# Altium project Compact Inverter Power V5.PrjPcb
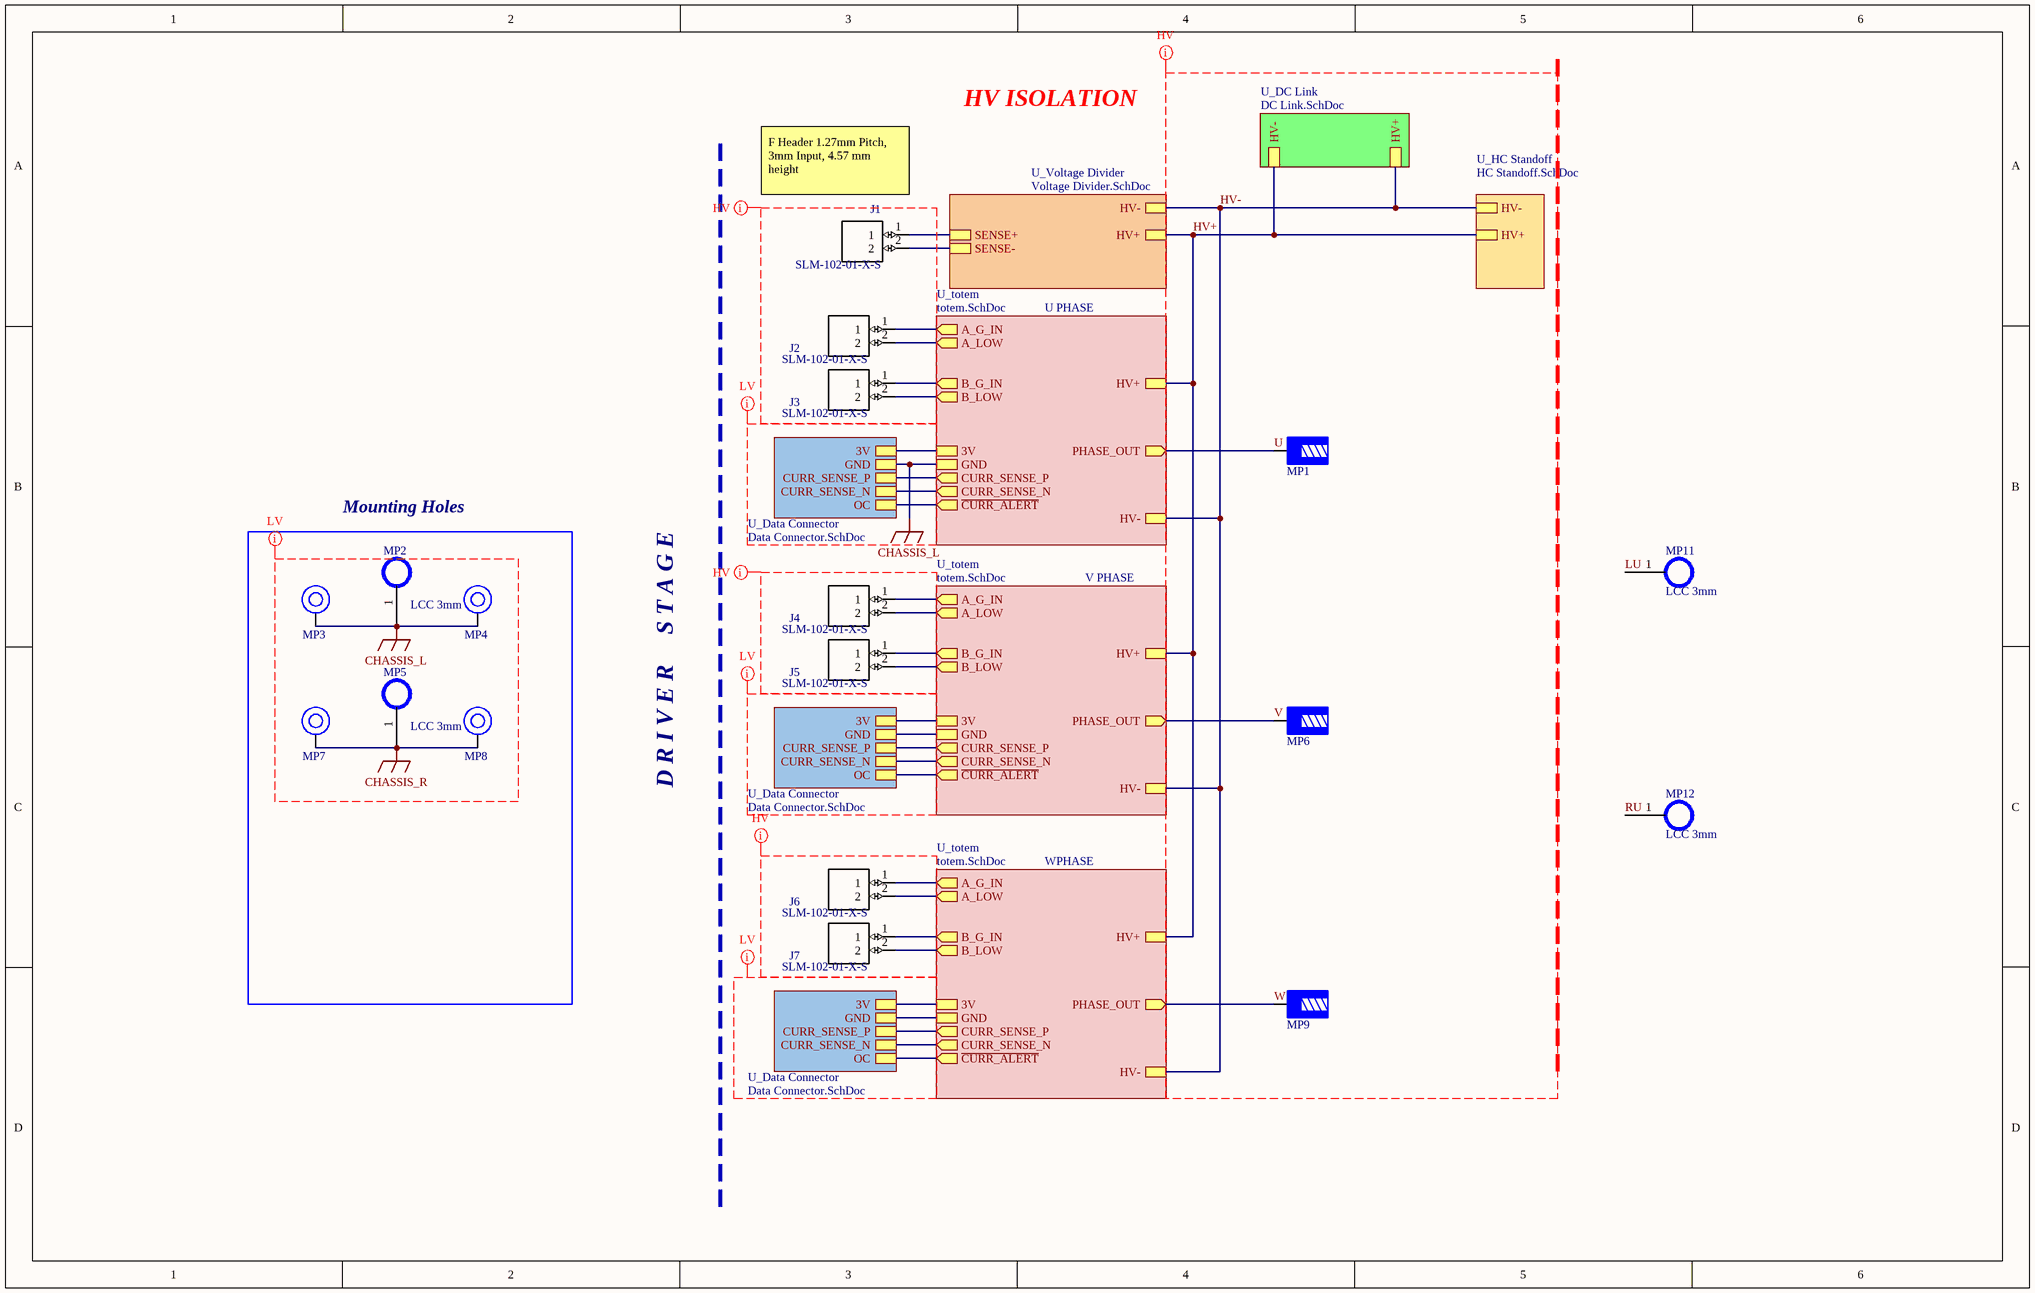
[diagram p0: Tree.SchDoc]
Model: 24
6 sheets, 79 parts. Net scope: strictly hierarchical (ports join the sheet entries above them; power ports are local).
Board file: PCB.PcbDoc
Sheets:
  Tree.SchDoc
    U_HC Standoff = HC Standoff.SchDoc
    U_Voltage Divider = Voltage Divider.SchDoc
    U_DC Link = DC Link.SchDoc
    U_Data Connector = Data Connector.SchDoc
    U_totem = totem.SchDoc
    U_Data Connector = Data Connector.SchDoc
    U_totem = totem.SchDoc
    U_Data Connector = Data Connector.SchDoc
    U_totem = totem.SchDoc

## Sheet Tree.SchDoc
size B; SheetNumber: 1; SheetTotal: 6

### Parts
J1  SLM-102-01-X-S  [*SLM-102-01-X-S]
J2  SLM-102-01-X-S  [*SLM-102-01-X-S]
J3  SLM-102-01-X-S  [*SLM-102-01-X-S]
J4  SLM-102-01-X-S  [*SLM-102-01-X-S]
J5  SLM-102-01-X-S  [*SLM-102-01-X-S]
J6  SLM-102-01-X-S  [*SLM-102-01-X-S]
J7  SLM-102-01-X-S  [*SLM-102-01-X-S]
MP1  M5 x 6mm  [7460305_HAL]  (value not drawn)
MP2  LCC 3mm  [PAD 3MM]
MP3  hole 3.3mm x 6mm  [9774060960]  (value not drawn)
MP4  hole 3.3mm x 6mm  [9774060960]  (value not drawn)
MP5  LCC 3mm  [PAD 3MM]
MP6  M5 x 6mm  [7460305_HAL]  (value not drawn)
MP7  hole 3.3mm x 6mm  [9774060960]  (value not drawn)
MP8  hole 3.3mm x 6mm  [9774060960]  (value not drawn)
MP9  M5 x 6mm  [7460305_HAL]  (value not drawn)
MP11  LCC 3mm  [PAD 3MM]
MP12  LCC 3mm  [PAD 3MM]

### Blocks framed on the sheet
Mounting Holes: MP2-MP5 MP7 MP8

### Sub-sheets
U_Data Connector = Data Connector.SchDoc: GND, OC, 3V, CURR_SENSE_P, CURR_SENSE_N
U_Data Connector = Data Connector.SchDoc: GND, OC, 3V, CURR_SENSE_P, CURR_SENSE_N
U_Data Connector = Data Connector.SchDoc: GND, OC, 3V, CURR_SENSE_P, CURR_SENSE_N
U_DC Link = DC Link.SchDoc: HV+, HV-
U_HC Standoff = HC Standoff.SchDoc: HV+, HV-
U_totem = totem.SchDoc: PHASE_OUT (out), B_LOW (out), B_G_IN (out), A_LOW (out), A_G_IN (out), ~{CURR_ALERT} (out), HV+, HV-, 3V, GND, CURR_SENSE_P (out), CURR_SENSE_N (out)
U_totem = totem.SchDoc: PHASE_OUT (out), B_LOW (out), B_G_IN (out), A_LOW (out), A_G_IN (out), ~{CURR_ALERT} (out), HV+, HV-, 3V, GND, CURR_SENSE_P (out), CURR_SENSE_N (out)
U_totem = totem.SchDoc: PHASE_OUT (out), B_LOW (out), B_G_IN (out), A_LOW (out), A_G_IN (out), ~{CURR_ALERT} (out), HV+, HV-, 3V, GND, CURR_SENSE_P (out), CURR_SENSE_N (out)
U_Voltage Divider = Voltage Divider.SchDoc: HV+, HV-, SENSE+, SENSE-  | ClassName: U PHASE

### Nets
3V: sheet U_Data Connector/3V, sheet U_totem/3V
3V: sheet U_Data Connector/3V, sheet U_totem/3V  [a separate net that carries the same name]
3V: sheet U_Data Connector/3V, sheet U_totem/3V  [a separate net that carries the same name]
CHASSIS_L: MP2.1 MP3.1 MP4.1 ; sheet U_Data Connector/GND, sheet U_totem/GND
CHASSIS_R: MP5.1 MP7.1 MP8.1
GND: sheet U_Data Connector/GND, sheet U_totem/GND
GND: sheet U_Data Connector/GND, sheet U_totem/GND  [a separate net that carries the same name]
~{OC_DET}: sheet U_Data Connector/OC, sheet U_totem/~{CURR_ALERT}
~{OC_DET}: sheet U_Data Connector/OC, sheet U_totem/~{CURR_ALERT}  [a separate net that carries the same name]
~{OC_DET}: sheet U_Data Connector/OC, sheet U_totem/~{CURR_ALERT}  [a separate net that carries the same name]
A_G_IN: J2.1 ; sheet U_totem/A_G_IN
A_G_IN: J4.1 ; sheet U_totem/A_G_IN  [a separate net that carries the same name]
A_G_IN: J6.1 ; sheet U_totem/A_G_IN  [a separate net that carries the same name]
A_LOW: J2.2 ; sheet U_totem/A_LOW
A_LOW: J4.2 ; sheet U_totem/A_LOW  [a separate net that carries the same name]
A_LOW: J6.2 ; sheet U_totem/A_LOW  [a separate net that carries the same name]
B_G_IN: J3.1 ; sheet U_totem/B_G_IN
B_G_IN: J5.1 ; sheet U_totem/B_G_IN  [a separate net that carries the same name]
B_G_IN: J7.1 ; sheet U_totem/B_G_IN  [a separate net that carries the same name]
B_LOW: J3.2 ; sheet U_totem/B_LOW
B_LOW: J5.2 ; sheet U_totem/B_LOW  [a separate net that carries the same name]
B_LOW: J7.2 ; sheet U_totem/B_LOW  [a separate net that carries the same name]
CURR_SENSE_N: sheet U_Data Connector/CURR_SENSE_N, sheet U_totem/CURR_SENSE_N
CURR_SENSE_N: sheet U_Data Connector/CURR_SENSE_N, sheet U_totem/CURR_SENSE_N  [a separate net that carries the same name]
CURR_SENSE_N: sheet U_Data Connector/CURR_SENSE_N, sheet U_totem/CURR_SENSE_N  [a separate net that carries the same name]
CURR_SENSE_P: sheet U_Data Connector/CURR_SENSE_P, sheet U_totem/CURR_SENSE_P
CURR_SENSE_P: sheet U_Data Connector/CURR_SENSE_P, sheet U_totem/CURR_SENSE_P  [a separate net that carries the same name]
CURR_SENSE_P: sheet U_Data Connector/CURR_SENSE_P, sheet U_totem/CURR_SENSE_P  [a separate net that carries the same name]
HV+: sheet U_HC Standoff/HV+, sheet U_Voltage Divider/HV+, sheet U_DC Link/HV-, sheet U_totem/HV+, sheet U_totem/HV+, sheet U_totem/HV+
HV-: J1.2 ; sheet U_HC Standoff/HV-, sheet U_Voltage Divider/HV-, sheet U_Voltage Divider/SENSE-, sheet U_DC Link/HV+, sheet U_totem/HV-, sheet U_totem/HV-, sheet U_totem/HV-
LU: MP11.1  [project net LU_1]
RU: MP12.1  [project net RU_1]
SENSE+: J1.1 ; sheet U_Voltage Divider/SENSE+
U: MP1.1 ; sheet U_totem/PHASE_OUT
V: MP6.1 ; sheet U_totem/PHASE_OUT
W: MP9.1 ; sheet U_totem/PHASE_OUT

### Layout directives
net class HV: (no net found under the mark), HV+, HV-, U, V, W
net class LV: (no net found under the mark), CHASSIS_L, CHASSIS_R

### Notes on the sheet
- HV ISOLATION
- (near J1) F Header 1.27mm Pitch, 3mm Input, 4.57 mm height
- U PHASE
- V PHASE
- D R I V E R     S T A G E
- WPHASE
- MY
- Project
- Author
- Revision
- Sheet
- Modified
- of

### Library data of the parts
MP1 MP6 MP9 = 7460305: WP-BUTR REDCUBE PRESS-FIT with internal thread, two-rows, L9W9H7mm, M5 x 6mm, 160A; Manufacturer: Wurth Elektronik; Surface: Tin; ComponentLink1Description: Website Link; ComponentLink1URL: https://www.we-online.com/redexpert/article/7460305?ad; ComponentLink2Description: Datasheet Link; ComponentLink2URL: https://www.we-online.com/redexpert/spec/7460305?ad; Manufacturer Part Number: 7460305; Category: REDCUBE PRESS-FIT; Match Code: WP-BUTR; Mount: Press Fit; Operating Temperature Max: 150°C; Operating Temperature Min: -55°C; Packaging: Bulk; Length: 9mm; Width: 9mm; Height: 7mm; Material: Brass; Number of Pins: 8; Rated Current: 160A; Thread Length: 6mm; Thread Size: M5
MP3 MP4 MP7 MP8 = 9774060960R: WA-SMST SMT Steel Spacer, OD 6mm, hole 3.3mm x 6mm; Manufacturer: Wurth Elektronik; Surface: Tin; ComponentLink1Description: Website Link; ComponentLink1URL: https://www.we-online.com/redexpert/article/9774060960R?ad; ComponentLink2Description: Datasheet Link; ComponentLink2URL: https://www.we-online.com/redexpert/spec/9774060960R?ad; Manufacturer Part Number: 9774060960R; Category: SMT Spacers; Match Code: WA-SMST; Mount: Surface Mount; Operating Temperature Max: 150°C; Operating Temperature Min: -55°C; Packaging: Tape and Reel; Height: 6mm; Inside Diameter: 3.3mm; Material: Steel; Outside Diameter: 6mm
J1-J7 = SLM-102-01-X-S: Value: *

## Sheet HC Standoff.SchDoc
size A; SheetNumber: 4; SheetTotal: 6
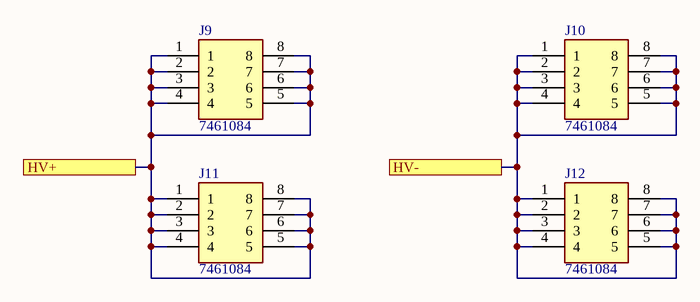
[diagram p1: HC Standoff.SchDoc]

### Parts
J9  7461084  [7461084]
J10  7461084  [7461084]
J11  7461084  [7461084]
J12  7461084  [7461084]

### Ports
HV+, HV-

### Nets
HV+: J9.1 J9.2 J9.3 J9.4 J9.5 J9.6 J9.7 J9.8 J11.1 J11.2 J11.3 J11.4 J11.5 J11.6 J11.7 J11.8 ; port HV+
HV-: J10.1 J10.2 J10.3 J10.4 J10.5 J10.6 J10.7 J10.8 J12.1 J12.2 J12.3 J12.4 J12.5 J12.6 J12.7 J12.8 ; port HV-

### Library data of the parts
J9-J12 = 7461084: Connector; Manufacturer_Name: Wurth Elektronik; Datasheet Link: https://www.we-online.com/components/products/download/3D+%28rev1%29.pdf; Height: 13.5mm; Manufacturer_Part_Number: 7461084; Mouser Part Number: 710-7461084; Mouser Price/Stock: https://www.mouser.co.uk/ProductDetail/Wurth-Elektronik/7461084?qs=lykWx4dhCCHlOeuPuO4BAQ%3D%3D

## Sheet Voltage Divider.SchDoc
size A; SheetNumber: 5; SheetTotal: 5
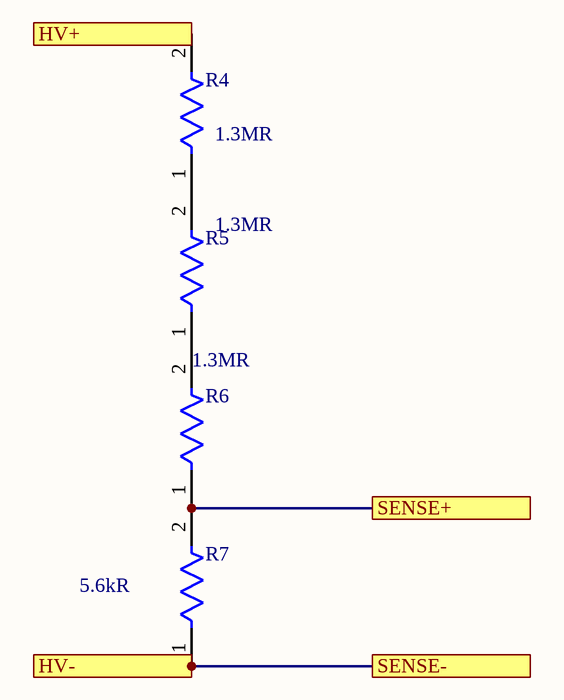
[diagram p2: Voltage Divider.SchDoc]

### Parts
R4  Resistance: 1.3MR  [FP-KTR10-MFG]  (hidden comment: KTR10EZPJ135)
R5  Resistance: 1.3MR  [FP-KTR10-MFG]  (hidden comment: KTR10EZPJ135)
R6  Resistance: 1.3MR  [FP-KTR10-MFG]  (hidden comment: KTR10EZPJ135)
R7  Resistance: 5.6kR  [FP-CRCW0603-e3-MFG]  (hidden comment: CRCW06035K60FKEA)

### Ports
HV+, HV-, SENSE+, SENSE-

### Nets
HV+: R4.2 ; port HV+
HV-: R7.1 ; port HV-, port SENSE-
SENSE+: R6.1 R7.2 ; port SENSE+
NetR4_1: R4.1 R5.2
NetR5_1: R5.1 R6.2

### Library data of the parts
R4-R6 = CMP-08839-031194-1: Res Thick Film 0805 1.3MΩ 5% 0.125W ±200ppm/°C Automotive Paper T/R; Max Power Dissipation: 125mW; Min Operating Temperature: -55°C; Tolerance: 5%; Max Operating Temperature: 155°C; Packaging: Tape and Reel; Resistor Type: Thick Film; Number of Terminations: 2; Length: 0.079inch; Height: 0.026inch; RoHS Compliant: Yes; Temperature Coefficient: 200ppm/°C; Width: 0.049inch; Series: KTR10; Case/Package: 0805; Package Quantity: 5000
R7 = CMP-2000-03487-2: RES Thick Film, 5.6kΩ, 1%, 0.1W, 100ppm/°C, 0603; Voltage Rating: 75V; Power Rating: 100mW; Packaging: Tape and Reel; Case/Package: 0603; Depth: 0.85mm; Package Quantity: 5000; Working Voltage: 75V; Case Code (Metric): 1608; Height: 0.45mm; Voltage Rating (DC): 75V; Tolerance: 1%; Number of Pins: 2; Weight: 7.1E-05oz; Composition: Thick Film; Width: 0.85mm; Temperature Coefficient: 100ppm/°C; Min Operating Temperature: -55°C; Radiation Hardening: No; Contact Plating: Tin; Case Code (Imperial): 0603; Max Operating Temperature: 155°C; Mount: Surface Mount; Length: 1.55mm; Lead Free: Lead Free; Military Standard: Not; Number of Terminations: 2; Termination: SMD/SMT

## Sheet DC Link.SchDoc
size A; SheetNumber: 6; SheetTotal: 6
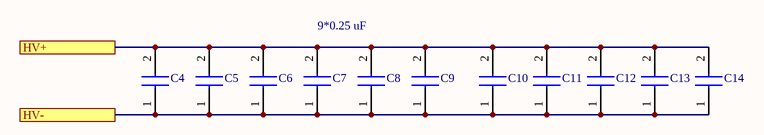
[diagram p3: DC Link.SchDoc]

### Parts
C4  B58031U9254M062  [B58031U9254M062]  (value not drawn)
C5  B58031U9254M062  [B58031U9254M062]  (value not drawn)
C6  B58031U9254M062  [B58031U9254M062]  (value not drawn)
C7  B58031U9254M062  [B58031U9254M062]  (value not drawn)
C8  B58031U9254M062  [B58031U9254M062]  (value not drawn)
C9  B58031U9254M062  [B58031U9254M062]  (value not drawn)
C10  B58031U9254M062  [B58031U9254M062]  (value not drawn)
C11  B58031U9254M062  [B58031U9254M062]  (value not drawn)
C12  B58031U9254M062  [B58031U9254M062]  (value not drawn)
C13  B58031U9254M062  [B58031U9254M062]  (value not drawn)
C14  B58031U9254M062  [B58031U9254M062]  (value not drawn)

### Ports
HV+, HV-

### Nets
HV+: C4.1 C5.1 C6.1 C7.1 C8.1 C9.1 C10.1 C11.1 C12.1 C13.1 C14.1 ; port HV-
HV-: C4.2 C5.2 C6.2 C7.2 C8.2 C9.2 C10.2 C11.2 C12.2 C13.2 C14.2 ; port HV+

### Notes on the sheet
- 9*0.25 uF

### Library data of the parts
C4-C14 = B58031U9254M062: Capacitor; Manufacturer_Name: TDK; Datasheet Link: https://product.tdk.com/system/files/dam/doc/product/capacitor/ceramic/ceralink/data_sheet/20/10/ds/b58031_lp.pdf; Height: 4.5mm; Manufacturer_Part_Number: B58031U9254M062; Mouser Part Number: 871-B58031U9254M062; Mouser Price/Stock: https://www.mouser.co.uk/ProductDetail/EPCOS-TDK/B58031U9254M062?qs=Mv7BduZupUir5egwM6Ifng%3D%3D; Arrow Part Number: B58031U9254M062; Arrow Price/Stock: https://www.arrow.com/en/products/b58031u9254m062/tdk?region=europe

## Sheet Data Connector.SchDoc
size A; SheetNumber: 3; SheetTotal: 6
Used 3 times, as channels U_Data Connector, U_Data Connector, U_Data Connector. Parts and nets are listed once, with the designators drawn on the sheet.
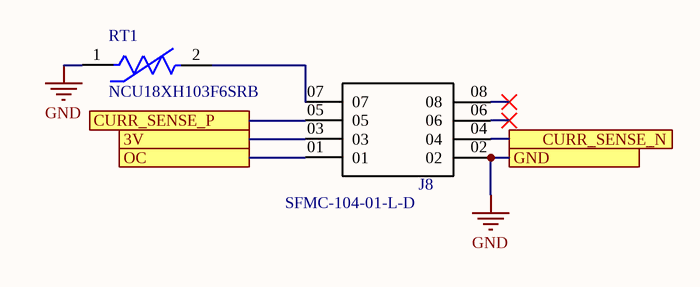
[diagram p4: Data Connector.SchDoc]

### Parts
J8  SFMC-104-01-L-D  [*SAMTEC_SFMC-104-01-L-D_SFMC-104-01-L-D(Primary)]
RT1  NCU18XH103F6SRB  [FP-NCU18-0_15-IPC_B]

### Ports
3V, CURR_SENSE_N, CURR_SENSE_P, GND, OC

### Nets
GND: J8.02 RT1.1 ; port GND
3V: J8.03 ; port 3V
CURR_SENSE_N: J8.04 ; port CURR_SENSE_N
CURR_SENSE_P: J8.05 ; port CURR_SENSE_P
OC: J8.01 ; port OC
NetJ8_07: J8.07 RT1.2

Not connected (* = marked no-connect by the designer): J8 06* 08*

### Channels
U_Data Connector: designators end in _U_Data_Connector#1; ports 3V=3V CURR_SENSE_N=CURR_SENSE_N CURR_SENSE_P=CURR_SENSE_P GND=CHASSIS_L OC=~{OC_DET}
U_Data Connector: designators end in _U_Data_Connector#2; ports 3V=3V CURR_SENSE_N=CURR_SENSE_N CURR_SENSE_P=CURR_SENSE_P GND=GND OC=~{OC_DET}
U_Data Connector: designators end in _U_Data_Connector#3; ports 3V=3V CURR_SENSE_N=CURR_SENSE_N CURR_SENSE_P=CURR_SENSE_P GND=GND OC=~{OC_DET}

### Library data of the parts
RT1 = CMP-06022-000547-2: THERMISTOR NTC; Min Operating Temperature: -40°C; Case Code (Metric): 1608; Max Operating Temperature: 150°C; RoHS Compliant: Yes; Case/Package: 0603; Case Code (Imperial): 0603; REACH SVHC: No SVHC
J8 = SFMC-104-01-L-D: Value: *

## Sheet totem.SchDoc
size A4; SheetNumber: 2; SheetTotal: 6
Used 3 times, as channels U_totem, U_totem, U_totem. Parts and nets are listed once, with the designators drawn on the sheet.
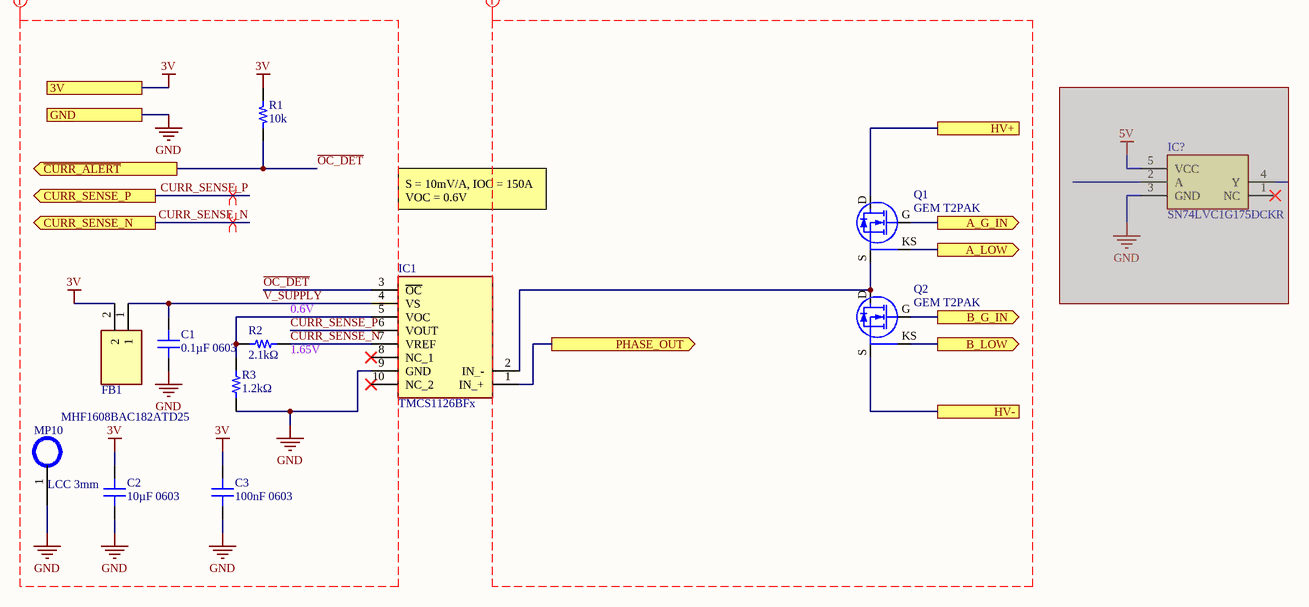
[diagram p5: totem.SchDoc]

### Parts
C1  0.1µF 0603  [0µF 0603-Footprint-1]
C2  10µF 0603  [0µF 0603-Footprint-1]
C3  100nF 0603  [0µF 0603-Footprint-1]
FB1  MHF1608BAC182ATD25  [BEADC1608X95N]
IC1  TMCS1126BFx  [TMCS1126ADxQ1]
IC?  SN74LVC1G175DCKR  [SOP65P210X110-6N]  (masked out: inside a compile mask, not in the netlist)
MP10  LCC 3mm  [PAD 3MM]
Q1  GEM T2PAK  [GEM T2PAK H3.6]
Q2  GEM T2PAK  [GEM T2PAK H3.6]
R1  10k  [RES 0603_1608]
R2  2.1kΩ  [RES 0603_1608]
R3  1.2kΩ  [RES 0603_1608]

### Ports
3V, A_G_IN (out), A_LOW (out), B_G_IN (out), B_LOW (out), CURR_SENSE_N (out), CURR_SENSE_P (out), GND, HV+, HV-, PHASE_OUT (out), ~{CURR_ALERT} (out)

### Nets
3V: C2.2 C3.2 FB1.2 R1.2 ; port 3V
GND: C1.1 C2.1 C3.1 IC1.9(GND) MP10.1 R3.2 ; port GND
~{OC_DET}: IC1.3(~{OC}) R1.1 ; port ~{CURR_ALERT}
A_G_IN: Q1.G ; port A_G_IN
A_LOW: Q1.KS ; port A_LOW
B_G_IN: Q2.G ; port B_G_IN
B_LOW: Q2.KS ; port B_LOW
CURR_SENSE_N: IC1.7(VREF) R2.1 ; port CURR_SENSE_N
CURR_SENSE_P: IC1.6(VOUT) ; port CURR_SENSE_P
HV+: Q1.D ; port HV+
HV-: Q2.S ; port HV-
PHASE_OUT: IC1.1(IN_+) ; port PHASE_OUT
V_SUPPLY: C1.2 FB1.1 IC1.4(VS)  [project net V_SUPPLY_2]
NetIC1_2: IC1.2(IN_-) Q1.S Q2.D
NetIC1_5: IC1.5(VOC) R2.2 R3.1

Not connected (* = marked no-connect by the designer): IC1 8(NC_1)* 10(NC_2)*

### Channels
U_totem: designators end in _U_totem#1; ports 3V=3V A_G_IN=A_G_IN A_LOW=A_LOW B_G_IN=B_G_IN B_LOW=B_LOW CURR_SENSE_N=CURR_SENSE_N CURR_SENSE_P=CURR_SENSE_P GND=CHASSIS_L HV+=HV+ HV-=HV- PHASE_OUT=U ~{CURR_ALERT}=~{OC_DET}
U_totem: designators end in _U_totem#2; ports 3V=3V A_G_IN=A_G_IN A_LOW=A_LOW B_G_IN=B_G_IN B_LOW=B_LOW CURR_SENSE_N=CURR_SENSE_N CURR_SENSE_P=CURR_SENSE_P GND=GND HV+=HV+ HV-=HV- PHASE_OUT=V ~{CURR_ALERT}=~{OC_DET}
U_totem: designators end in _U_totem#3; ports 3V=3V A_G_IN=A_G_IN A_LOW=A_LOW B_G_IN=B_G_IN B_LOW=B_LOW CURR_SENSE_N=CURR_SENSE_N CURR_SENSE_P=CURR_SENSE_P GND=GND HV+=HV+ HV-=HV- PHASE_OUT=W ~{CURR_ALERT}=~{OC_DET}

### Layout directives
differential pair: CURR_SENSE_N, CURR_SENSE_P
net class LV: 3V, CURR_SENSE_N, CURR_SENSE_P, GND, V_SUPPLY, ~{OC_DET}
net class HV: (no net found under the mark)

### Notes on the sheet
- S = 10mV/A, IOC = 150A
  VOC = 0.6V
- (near R2) 0.6V
- (near R2) 1.65V
- MY
- 25
- Project:
- Author
- Revision
- Sheet
- Modified
- of

### Library data of the parts
C1-C3 = CMP-714-000037-1: Generic 0603 Capacitor; ComponentLink2Description: DigiKey Link; ComponentLink1Description: Datasheet
FB1 = MHF1608BAC182ATD25: Filter; Manufacturer_Name: TDK; Datasheet Link: https://product.tdk.com/system/files/dam/doc/product/emc/emc/suppression-filter/catalog/suppression-filter_automotive_mhf1608_en.pdf; Height: 0.95mm; Manufacturer_Part_Number: MHF1608BAC182ATD25; Mouser Part Number: 810-MHF1608BAC182ATD; Mouser Price/Stock: https://www.mouser.co.uk/ProductDetail/TDK/MHF1608BAC182ATD25?qs=sPbYRqrBIVkck8qVgrG13Q%3D%3D; Arrow Part Number: MHF1608BAC182ATD25; Arrow Price/Stock: https://www.arrow.com/en/products/mhf1608bac182atd25/tdk?region=europe
IC1 = TMCS1126ADx-Q1: Integrated Circuit; Manufacturer_Name: Texas Instruments; Datasheet Link: https://www.ti.com/lit/ds/symlink/tmcs1126-q1.pdf?ts=1750416569069&ref_url=https%253A%252F%252Fwww.ti.com%252Fproduct%252FTMCS1126-Q1; Height: 2.65mm; Manufacturer_Part_Number: TMCS1126ADx-Q1
IC? = SN74LVC1G175DCKR: Integrated Circuit; Manufacturer_Name: Texas Instruments; Datasheet Link: http://www.ti.com/lit/gpn/sn74lvc1g175; Height: 1.1mm; Manufacturer_Part_Number: SN74LVC1G175DCKR; Mouser Part Number: 595-SN74LVC1G175DCKR; Mouser Price/Stock: https://www.mouser.co.uk/ProductDetail/Texas-Instruments/SN74LVC1G175DCKR?qs=pajgIaoyDUjI2BH1x6CpqQ%3D%3D; Arrow Part Number: SN74LVC1G175DCKR; Arrow Price/Stock: https://www.arrow.com/en/products/sn74lvc1g175dckr/texas-instruments?region=nac
R1 = RNCS0603BKE10K0: RES 10K OHM 0.1% 1/16W 0603; Manufacturer: Stackpole Electronics Inc; Value: 1k; Power (Watts): 0.063W, 1/16W; Resistance: 10 kOhms; Temperature Coefficient: ±25ppm/°C; Part Number: RNCS0603BKE10K0; ComponentLink1Description: Datasheet; ComponentLink1URL: https://www.seielect.com/catalog/sei-rncs_rnch.pdf; ComponentLink2Description: DigiKey Link; ComponentLink2URL: https://www.digikey.com/en/products/detail/stackpole-electronics-inc/RNCS0603BKE10K0/1708836; Composition: Thin Film; Device Package: 0603 (1608 Metric); Features: Anti-Corrosive, Automotive AEC-Q200, Moisture Resistant; Height - Seated (Max): 0.022" (0.55mm); LastUpdated: 2/9/2024 8:43:37 PM; Lifecycle Status: Active; Minimum Order: 1; Number of Terminations: 2; Operating Temperature: -55°C ~ 155°C; Package / Case: 0603 (1608 Metric); Packaging: TapeAndReel; PartId: 4838; Part Status: Active; Price: 0.06; Ratings: AEC-Q200; Series: RNCS; Size / Dimension: 0.061" L x 0.031" W (1.55mm x 0.80mm); Supplier 1: DigiKey; Supplier Part Number 1: RNCS0603BKE10K0CT-ND; Supplier Device Package: 0603; Tolerance: ±0.1%
R2 R3 = CMP-650-000035-3: Generic 0603 Resistor

## Nets that join several sheets
3V: U_Data Connector (J8_U_Data_Connector#1.03), U_totem (C2_U_totem#1.2 C3_U_totem#1.2 FB1_U_totem#1.2 R1_U_totem#1.2)
3V: U_Data Connector (J8_U_Data_Connector#2.03), U_totem (C2_U_totem#2.2 C3_U_totem#2.2 FB1_U_totem#2.2 R1_U_totem#2.2)
3V: U_Data Connector (J8_U_Data_Connector#3.03), U_totem (C2_U_totem#3.2 C3_U_totem#3.2 FB1_U_totem#3.2 R1_U_totem#3.2)
CHASSIS_L: Tree (MP2.1 MP3.1 MP4.1), U_Data Connector (J8_U_Data_Connector#1.02 RT1_U_Data_Connector#1.1), U_totem (6 pins)
GND: U_Data Connector (J8_U_Data_Connector#2.02 RT1_U_Data_Connector#2.1), U_totem (6 pins)
GND: U_Data Connector (J8_U_Data_Connector#3.02 RT1_U_Data_Connector#3.1), U_totem (6 pins)
~{OC_DET}: U_Data Connector (J8_U_Data_Connector#1.01), U_totem (IC1_U_totem#1.3 R1_U_totem#1.1)
~{OC_DET}: U_Data Connector (J8_U_Data_Connector#2.01), U_totem (IC1_U_totem#2.3 R1_U_totem#2.1)
~{OC_DET}: U_Data Connector (J8_U_Data_Connector#3.01), U_totem (IC1_U_totem#3.3 R1_U_totem#3.1)
A_G_IN: Tree (J2.1), U_totem (Q1_U_totem#1.G)
A_G_IN: Tree (J4.1), U_totem (Q1_U_totem#2.G)
A_G_IN: Tree (J6.1), U_totem (Q1_U_totem#3.G)
A_LOW: Tree (J2.2), U_totem (Q1_U_totem#1.KS)
A_LOW: Tree (J4.2), U_totem (Q1_U_totem#2.KS)
A_LOW: Tree (J6.2), U_totem (Q1_U_totem#3.KS)
B_G_IN: Tree (J3.1), U_totem (Q2_U_totem#1.G)
B_G_IN: Tree (J5.1), U_totem (Q2_U_totem#2.G)
B_G_IN: Tree (J7.1), U_totem (Q2_U_totem#3.G)
B_LOW: Tree (J3.2), U_totem (Q2_U_totem#1.KS)
B_LOW: Tree (J5.2), U_totem (Q2_U_totem#2.KS)
B_LOW: Tree (J7.2), U_totem (Q2_U_totem#3.KS)
CURR_SENSE_N: U_Data Connector (J8_U_Data_Connector#1.04), U_totem (IC1_U_totem#1.7 R2_U_totem#1.1)
CURR_SENSE_N: U_Data Connector (J8_U_Data_Connector#2.04), U_totem (IC1_U_totem#2.7 R2_U_totem#2.1)
CURR_SENSE_N: U_Data Connector (J8_U_Data_Connector#3.04), U_totem (IC1_U_totem#3.7 R2_U_totem#3.1)
CURR_SENSE_P: U_Data Connector (J8_U_Data_Connector#1.05), U_totem (IC1_U_totem#1.6)
CURR_SENSE_P: U_Data Connector (J8_U_Data_Connector#2.05), U_totem (IC1_U_totem#2.6)
CURR_SENSE_P: U_Data Connector (J8_U_Data_Connector#3.05), U_totem (IC1_U_totem#3.6)
HV+: HC Standoff (16 pins), Voltage Divider (R4.2), DC Link (11 pins), U_totem (Q1_U_totem#1.D), U_totem (Q1_U_totem#2.D), U_totem (Q1_U_totem#3.D)
HV-: Tree (J1.2), HC Standoff (16 pins), Voltage Divider (R7.1), DC Link (11 pins), U_totem (Q2_U_totem#1.S), U_totem (Q2_U_totem#2.S), U_totem (Q2_U_totem#3.S)
SENSE+: Tree (J1.1), Voltage Divider (R6.1 R7.2)
U: Tree (MP1.1), U_totem (IC1_U_totem#1.1)
V: Tree (MP6.1), U_totem (IC1_U_totem#2.1)
W: Tree (MP9.1), U_totem (IC1_U_totem#3.1)